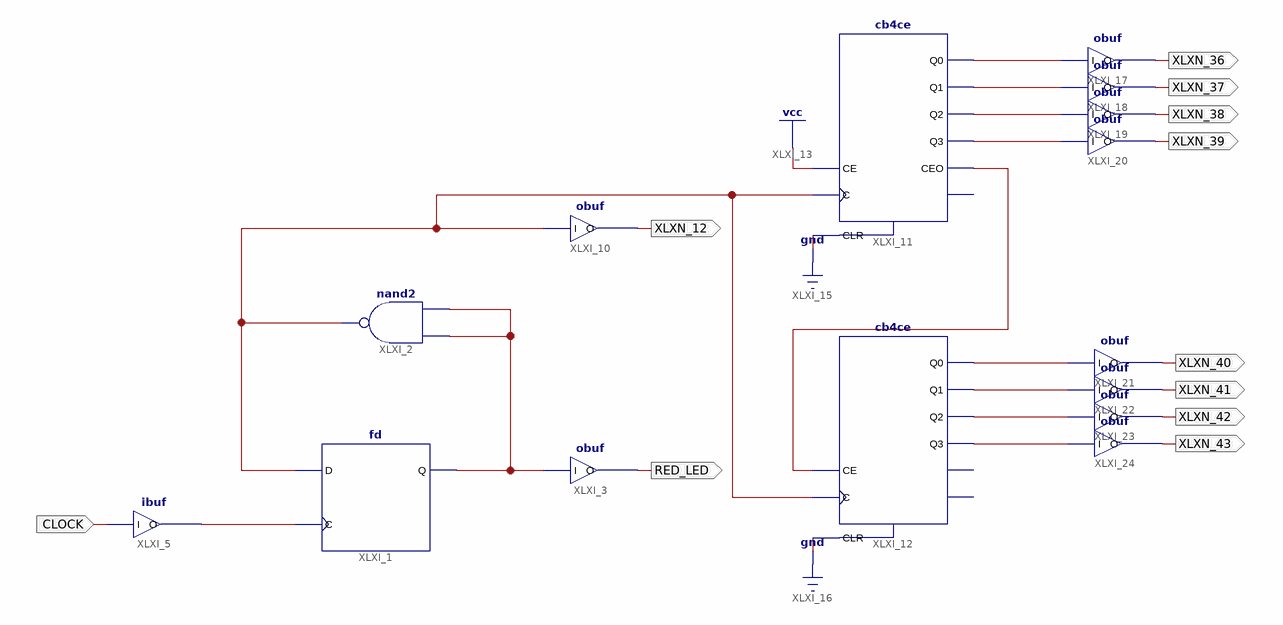
[diagram p0: schematic sheet 1]
// Xilinx ISE schematic blink.sch (xc9500xl) as structural Verilog: 15 symbols, 11 ports
module blink (
  input  CLOCK,
  output RED_LED,
  output XLXN_12,
  output XLXN_36,
  output XLXN_37,
  output XLXN_38,
  output XLXN_39,
  output XLXN_40,
  output XLXN_41,
  output XLXN_42,
  output XLXN_43
);

  wire XLXN_2, XLXN_3, XLXN_13, XLXN_26, XLXN_27, XLXN_28, XLXN_31, XLXN_32, XLXN_33, XLXN_34, XLXN_47,
       XLXN_49;

  fd XLXI_1 (.C(XLXN_2), .D(XLXN_49), .Q(XLXN_3));
  nand XLXI_2 (XLXN_49, XLXN_3, XLXN_3);
  obuf #(.LOC("p2")) XLXI_3 (.I(XLXN_3), .O(RED_LED));
  ibuf #(.LOC("p5")) XLXI_5 (.I(CLOCK), .O(XLXN_2));
  obuf #(.LOC("p1")) XLXI_10 (.I(XLXN_49), .O(XLXN_12));
  cb4ce XLXI_11 (
    .C(XLXN_49), .CE(1'b1), .CLR(1'b0), .CEO(XLXN_13), .Q0(XLXN_26), .Q1(XLXN_27), .Q2(XLXN_28), .Q3(XLXN_47));  // open: TC
  cb4ce XLXI_12 (
    .C(XLXN_49), .CE(XLXN_13), .CLR(1'b0), .Q0(XLXN_31), .Q1(XLXN_32), .Q2(XLXN_33), .Q3(XLXN_34));  // open: CEO, TC
  obuf #(.LOC("p11")) XLXI_17 (.I(XLXN_26), .O(XLXN_36));
  obuf #(.LOC("p12")) XLXI_18 (.I(XLXN_27), .O(XLXN_37));
  obuf #(.LOC("p13")) XLXI_19 (.I(XLXN_28), .O(XLXN_38));
  obuf #(.LOC("p14")) XLXI_20 (.I(XLXN_47), .O(XLXN_39));
  obuf #(.LOC("p18")) XLXI_21 (.I(XLXN_31), .O(XLXN_40));
  obuf #(.LOC("p19")) XLXI_22 (.I(XLXN_32), .O(XLXN_41));
  obuf #(.LOC("p20")) XLXI_23 (.I(XLXN_33), .O(XLXN_42));
  obuf #(.LOC("p22")) XLXI_24 (.I(XLXN_34), .O(XLXN_43));
endmodule
